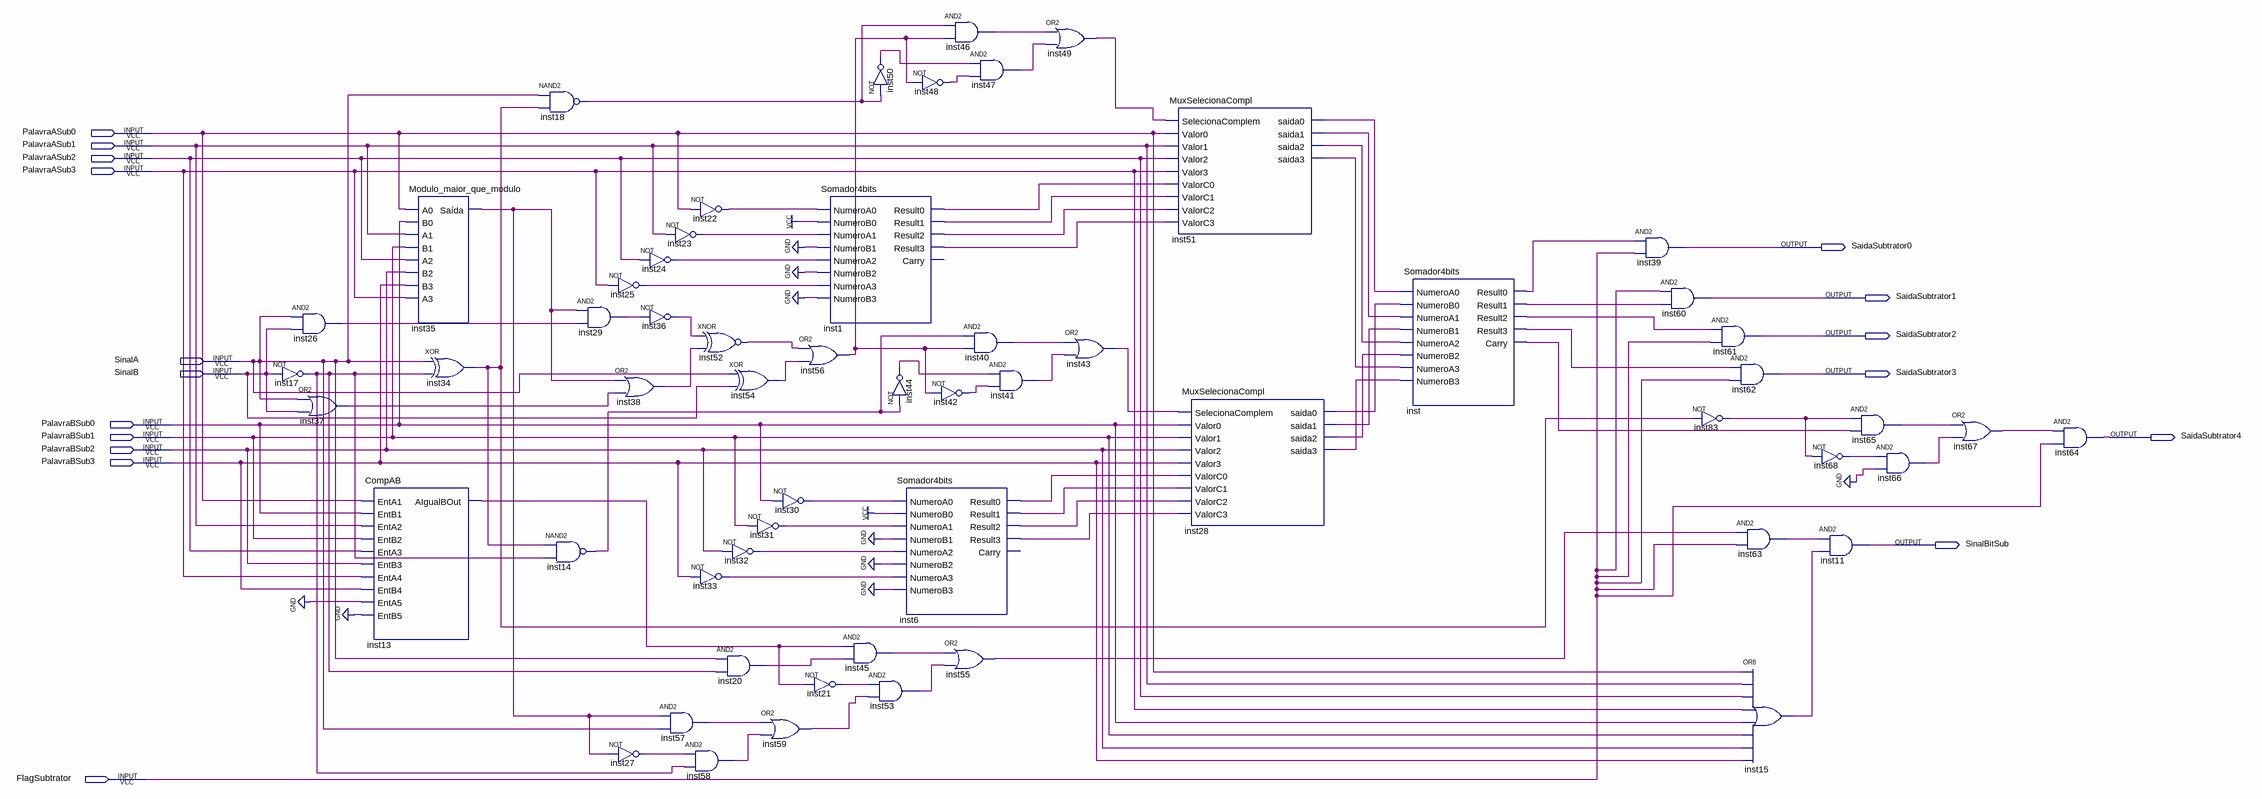
[diagram p0: schematic sheet]
// Quartus schematic Subtrator.bdf as structural Verilog: 59 symbols, 17 pins
module Subtrator (
  input  PalavraASub0,
  input  PalavraASub1,
  input  PalavraASub2,
  input  PalavraASub3,
  input  SinalA,
  input  SinalB,
  input  PalavraBSub0,
  input  PalavraBSub1,
  input  PalavraBSub2,
  input  PalavraBSub3,
  input  FlagSubtrator,
  output SaidaSubtrator0,
  output SaidaSubtrator1,
  output SaidaSubtrator2,
  output SaidaSubtrator3,
  output SaidaSubtrator4,
  output SinalBitSub
);

  wire inst1_result0, inst1_result1, inst1_result2, inst1_result3, inst6_result0, inst6_result1,
       inst6_result2, inst6_result3, inst13_aigualbout, inst14_out, inst15_out, inst17_out, inst18_out,
       inst20_out, inst21_out, inst22_out, inst23_out, inst24_out, inst25_out, inst26_out, inst27_out,
       inst28_saida0, inst28_saida1, inst28_saida2, inst28_saida3, inst29_out, inst30_out, inst31_out,
       inst32_out, inst33_out, inst34_out, \inst35_saída , inst36_out, inst37_out, inst38_out, inst40_out,
       inst41_out, inst42_out, inst43_out, inst44_out, inst45_out, inst46_out, inst47_out, inst48_out,
       inst49_out, inst50_out, inst51_saida0, inst51_saida1, inst51_saida2, inst51_saida3, inst52_out,
       inst53_out, inst54_out, inst55_out, inst56_out, inst57_out, inst58_out, inst59_out, inst63_out,
       inst65_out, inst66_out, inst67_out, inst68_out, inst83_out, inst_carry, inst_result0, inst_result1,
       inst_result2, inst_result3;

  and inst26 (inst26_out, SinalA, SinalB);
  not inst17 (inst17_out, SinalB);
  or inst37 (inst37_out, SinalA, SinalB);
  CompAB inst13 (
    .EntA1(PalavraASub0), .EntB1(PalavraBSub0), .EntA2(PalavraASub1), .EntB2(PalavraBSub1),
    .EntA3(PalavraASub2), .EntB3(PalavraBSub2), .EntA4(PalavraASub3), .EntB4(PalavraBSub3), .EntA5(1'b0),
    .EntB5(1'b0), .AIgualBOut(inst13_aigualbout));
  Modulo_maior_que_modulo inst35 (
    .A0(PalavraASub0), .B0(PalavraBSub0), .A1(PalavraASub1), .B1(PalavraBSub1), .A2(PalavraASub2),
    .B2(PalavraBSub2), .B3(PalavraBSub3), .A3(PalavraASub3), .\Saída (\inst35_saída ));
  xor inst34 (inst34_out, SinalA, inst17_out);
  nand inst18 (inst18_out, SinalA, inst34_out);
  nand inst14 (inst14_out, inst34_out, inst17_out);
  not inst25 (inst25_out, PalavraASub3);
  and inst29 (inst29_out, \inst35_saída , inst26_out);
  or inst38 (inst38_out, \inst35_saída , inst37_out);
  not inst27 (inst27_out, \inst35_saída );
  not inst23 (inst23_out, PalavraASub1);
  not inst24 (inst24_out, PalavraASub2);
  not inst36 (inst36_out, inst29_out);
  and inst57 (inst57_out, \inst35_saída , SinalA);
  not inst22 (inst22_out, PalavraASub0);
  xnor inst52 (inst52_out, inst36_out, inst38_out);
  not inst32 (inst32_out, PalavraBSub2);
  not inst33 (inst33_out, PalavraBSub3);
  and inst20 (inst20_out, SinalA, inst17_out);
  and inst58 (inst58_out, inst27_out, inst17_out);
  xor inst54 (inst54_out, SinalA, SinalB);
  not inst30 (inst30_out, PalavraBSub0);
  not inst31 (inst31_out, PalavraBSub1);
  or inst59 (inst59_out, inst57_out, inst58_out);
  Somador4bits inst1 (
    .NumeroA0(inst22_out), .NumeroB0(1'b1), .NumeroA1(inst23_out), .NumeroB1(1'b0), .NumeroA2(inst24_out),
    .NumeroB2(1'b0), .NumeroA3(inst25_out), .NumeroB3(1'b0), .Result0(inst1_result0),
    .Result1(inst1_result1), .Result2(inst1_result2), .Result3(inst1_result3));  // open: Carry
  or inst56 (inst56_out, inst52_out, inst54_out);
  not inst21 (inst21_out, inst13_aigualbout);
  not inst50 (inst50_out, inst18_out);
  and inst45 (inst45_out, inst13_aigualbout, inst20_out);
  and inst53 (inst53_out, inst21_out, inst59_out);
  not inst48 (inst48_out, inst56_out);
  not inst44 (inst44_out, inst14_out);
  Somador4bits inst6 (
    .NumeroA0(inst30_out), .NumeroB0(1'b1), .NumeroA1(inst31_out), .NumeroB1(1'b0), .NumeroA2(inst32_out),
    .NumeroB2(1'b0), .NumeroA3(inst33_out), .NumeroB3(1'b0), .Result0(inst6_result0),
    .Result1(inst6_result1), .Result2(inst6_result2), .Result3(inst6_result3));  // open: Carry
  and inst46 (inst46_out, inst18_out, inst56_out);
  and inst47 (inst47_out, inst50_out, inst48_out);
  and inst40 (inst40_out, inst14_out, inst56_out);
  not inst42 (inst42_out, inst56_out);
  or inst55 (inst55_out, inst45_out, inst53_out);
  and inst41 (inst41_out, inst44_out, inst42_out);
  or inst49 (inst49_out, inst46_out, inst47_out);
  or inst43 (inst43_out, inst40_out, inst41_out);
  MuxSelecionaCompl inst51 (
    .SelecionaComplem(inst49_out), .Valor0(PalavraASub0), .Valor1(PalavraASub1), .Valor2(PalavraASub2),
    .Valor3(PalavraASub3), .ValorC0(inst1_result0), .ValorC1(inst1_result1), .ValorC2(inst1_result2),
    .ValorC3(inst1_result3), .saida0(inst51_saida0), .saida1(inst51_saida1), .saida2(inst51_saida2),
    .saida3(inst51_saida3));
  MuxSelecionaCompl inst28 (
    .SelecionaComplem(inst43_out), .Valor0(PalavraBSub0), .Valor1(PalavraBSub1), .Valor2(PalavraBSub2),
    .Valor3(PalavraBSub3), .ValorC0(inst6_result0), .ValorC1(inst6_result1), .ValorC2(inst6_result2),
    .ValorC3(inst6_result3), .saida0(inst28_saida0), .saida1(inst28_saida1), .saida2(inst28_saida2),
    .saida3(inst28_saida3));
  Somador4bits inst (
    .NumeroA0(inst51_saida0), .NumeroB0(inst28_saida0), .NumeroA1(inst51_saida1), .NumeroB1(inst28_saida1),
    .NumeroA2(inst51_saida2), .NumeroB2(inst28_saida2), .NumeroA3(inst51_saida3), .NumeroB3(inst28_saida3),
    .Result0(inst_result0), .Result1(inst_result1), .Result2(inst_result2), .Result3(inst_result3),
    .Carry(inst_carry));
  and inst39 (SaidaSubtrator0, inst_result0, FlagSubtrator);
  and inst60 (SaidaSubtrator1, FlagSubtrator, inst_result1);
  and inst61 (SaidaSubtrator2, inst_result2, FlagSubtrator);
  and inst62 (SaidaSubtrator3, inst_result3, FlagSubtrator);
  not inst83 (inst83_out, inst34_out);
  and inst63 (inst63_out, inst55_out, FlagSubtrator);
  or inst15 (inst15_out, PalavraASub0, PalavraASub1, PalavraASub2, PalavraASub3, PalavraBSub0, PalavraBSub1, PalavraBSub2, PalavraBSub3);
  not inst68 (inst68_out, inst83_out);
  and inst11 (SinalBitSub, inst63_out, inst15_out);
  and inst65 (inst65_out, inst83_out, inst_carry);
  and inst66 (inst66_out, inst68_out, 1'b0);
  or inst67 (inst67_out, inst65_out, inst66_out);
  and inst64 (SaidaSubtrator4, inst67_out, FlagSubtrator);
endmodule
